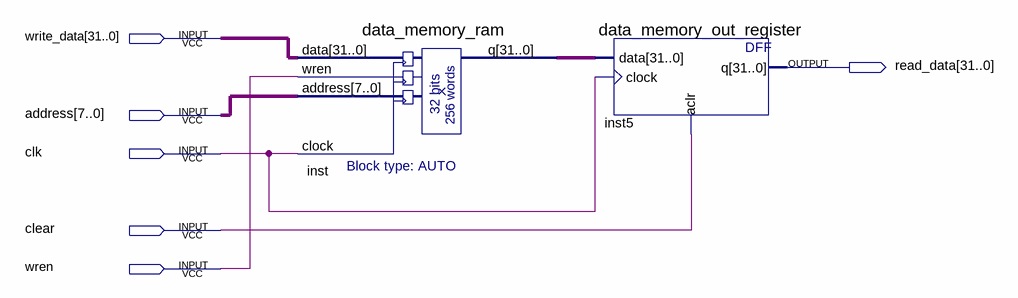
[diagram p0: schematic sheet]
// Quartus schematic Data_Memory.bdf as structural Verilog: 2 symbols, 6 pins
module Data_Memory (
  input  [31:0] write_data,
  input  [7:0] address,
  input  clk,
  input  clear,
  input  wren,
  output [31:0] read_data
);

  wire [31:0] inst_q;

  data_memory_ram inst (.data(write_data), .wren(wren), .address(address), .clock(clk), .q(inst_q));
  data_memory_out_register inst5 (.data(inst_q), .clock(clk), .aclr(clear), .q(read_data));
endmodule
